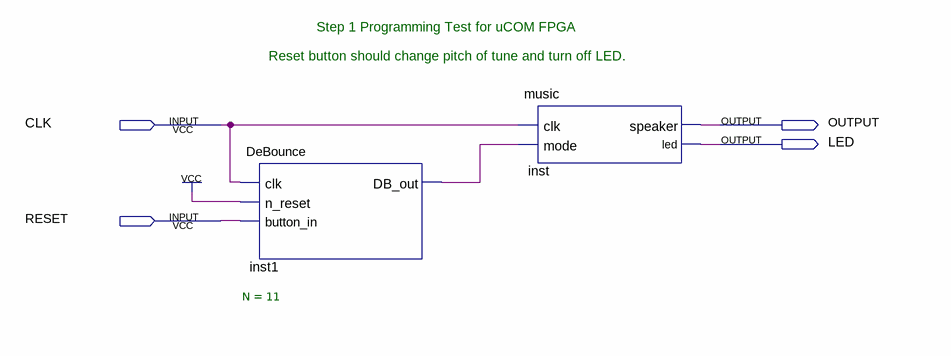
[diagram p0: schematic sheet]
// Quartus schematic AudioTest.bdf as structural Verilog: 2 symbols, 4 pins
module AudioTest (
  input  CLK,
  input  RESET,
  output OUTPUT,
  output LED
);

  wire inst1_db_out;

  DeBounce #(.N(11)) inst1 (.clk(CLK), .n_reset(1'b1), .button_in(RESET), .DB_out(inst1_db_out));
  music inst (.clk(CLK), .mode(inst1_db_out), .speaker(OUTPUT), .led(LED));

  // Notes on the sheet:
  //   Step 1 Programming Test for uCOM FPGA
  //   Reset button should change pitch of tune and turn off LED.
endmodule
